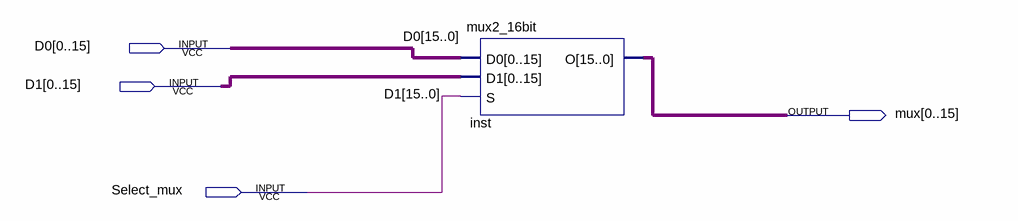
[diagram p0: schematic sheet]
// Quartus schematic tesst.bdf as structural Verilog: 1 symbols, 4 pins
module tesst (
  input  [0:15] D0,
  input  [0:15] D1,
  input  Select_mux,
  output [0:15] mux
);

  mux2_16bit inst (
    .D0({D0[15], D0[14], D0[13], D0[12], D0[11], D0[10], D0[9], D0[8], D0[7], D0[6], D0[5], D0[4], D0[3], D0[2], D0[1], D0[0]}),
    .D1({D1[15], D1[14], D1[13], D1[12], D1[11], D1[10], D1[9], D1[8], D1[7], D1[6], D1[5], D1[4], D1[3], D1[2], D1[1], D1[0]}),
    .S(Select_mux), .O(mux));
endmodule
